# EAGLE design CCM_0019 (EAGLE 9.2.1)
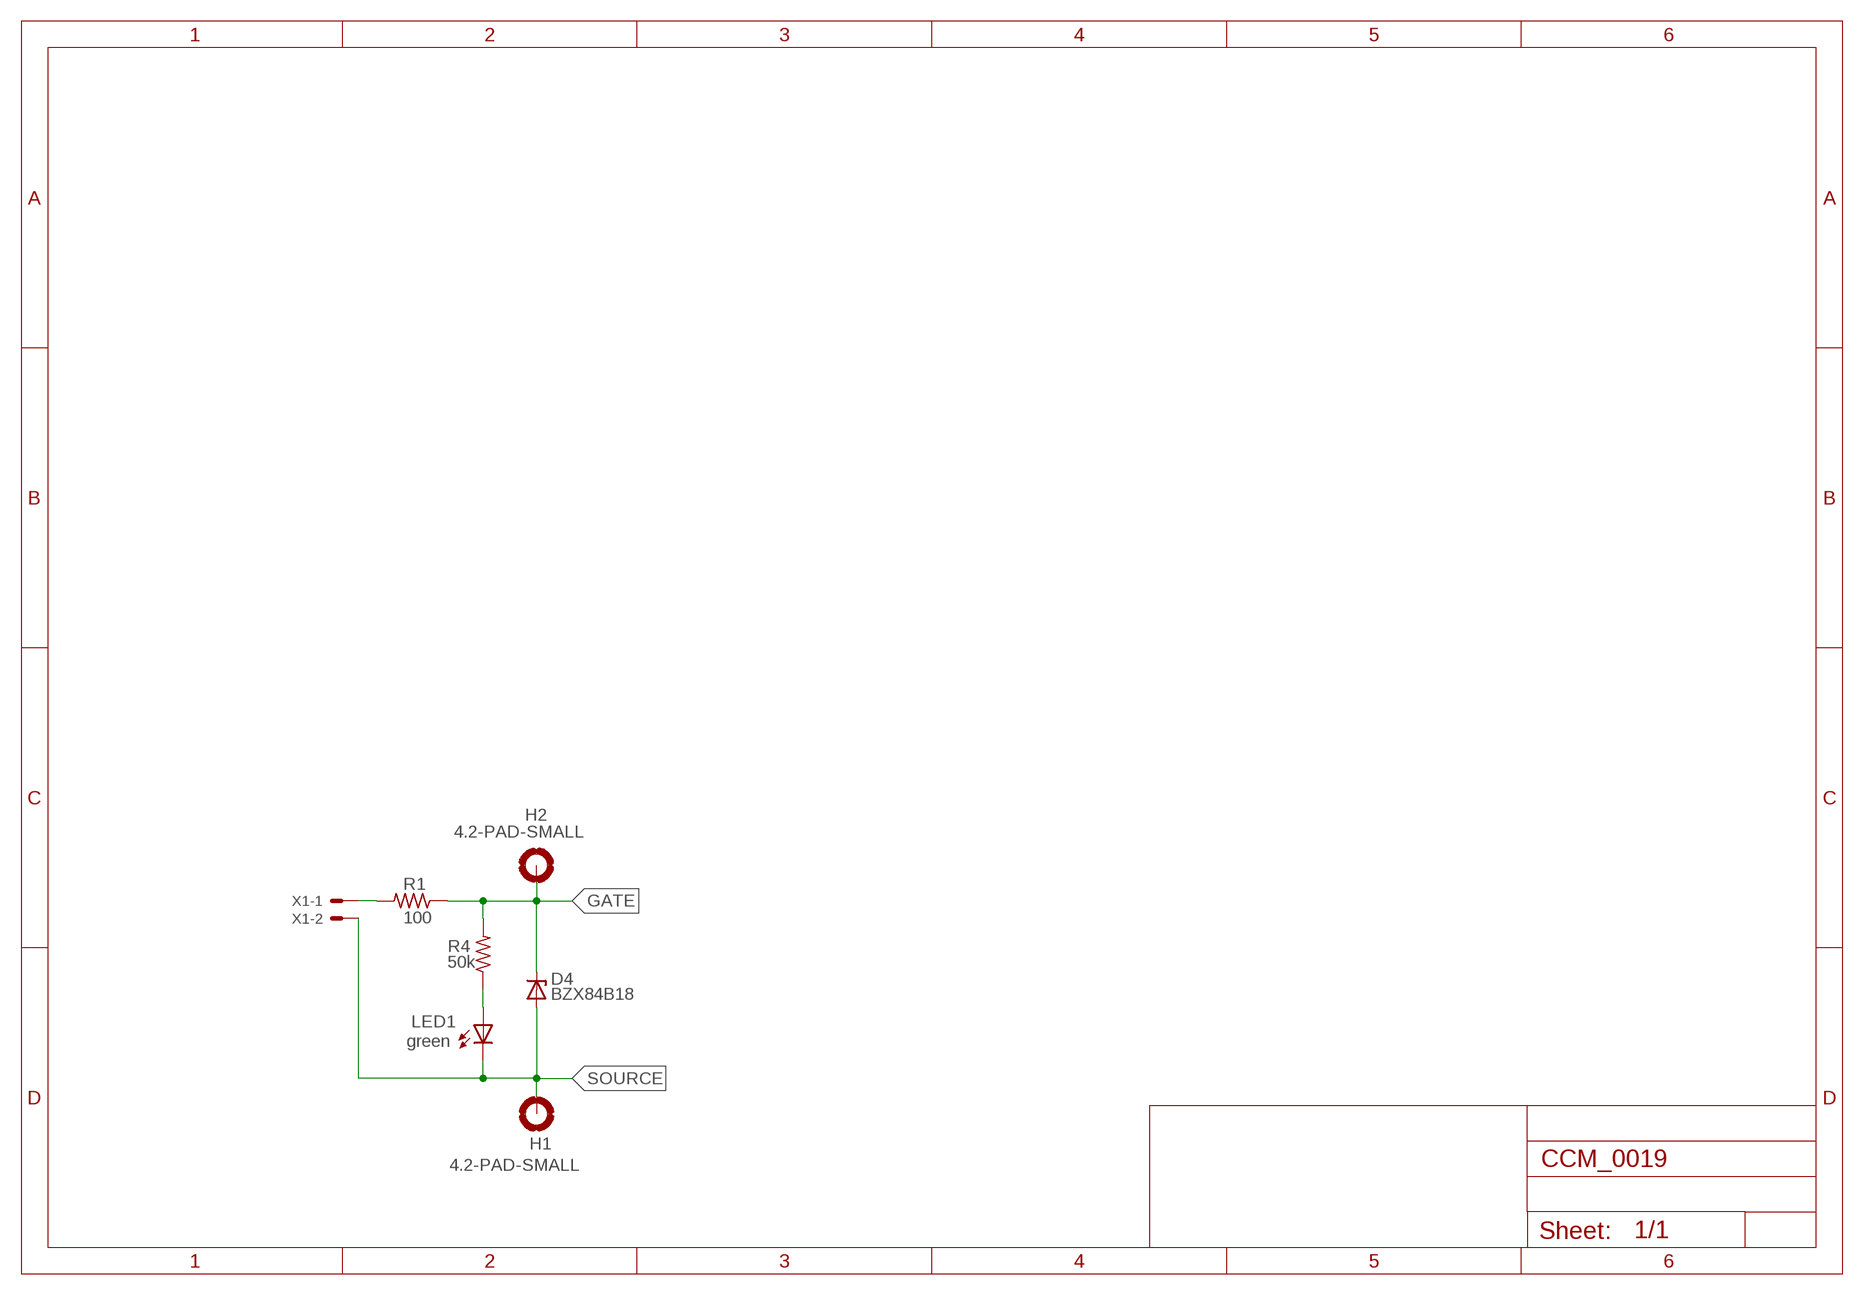
[diagram p0: schematic, sheet 1]

## Parts
D4  BZX84B18  ZENER-DIODESOT23  [SOT23]
H1  4.2-PAD-SMALL  [4.2-PAD-SMALL]
H2  4.2-PAD-SMALL  [4.2-PAD-SMALL]
LED1  green  LEDCHIPLED_0603  [CHIPLED_0603]
R1  100  RESISTOR0603  [0603]
R4  50k  RESISTOR0603  [0603]
X1  22-23-2021  [22-23-2021]

## Nets
GATE: D4.3(C) H2.B4,2(MOUNT) R1.1 R4.2
N$2: LED1.A R4.1
N$5: R1.2 X1.1
SOURCE: D4.1(A) H1.B4,2(MOUNT) LED1.C X1.2

## Library data of the parts
D4 = diode:ZENER-DIODE: Z-Diode
H1 H2 = noah:4.2-PAD-SMALL
LED1 = led:LED: LED OSRAM: - CHIPLED LG R971, LG N971, LY N971, LG Q971, LY Q971, LO R971, LY R971 LH N974, LH R974 LS Q976, LO Q976, LY Q976 LO Q996 - Hyper CHIPLED LW Q18S LB Q993, LB Q99A, LB R99A - SideLED LS A670, LO A670, LY A670, LG A670, LP A670 LB A673, LV A673, LT A673, LW A673 LH A674 LY A675 LS A676, LA A676, LO A676, LY A676, LW A676 LS A679, LY A679, LG A679 - Hyper Micro SIDELED® LS Y876, LA Y876, LO Y876, LY Y876 LT Y87S - SmartLED LW L88C, LW L88S LB L89C, LB L89S, LG L890 LS L89K, LO L89K, LY L89K LS L896, LA L896, LO L896, LY L896 - TOPLED LS T670, LO T670, LY T670, LG T670, LP T670 LSG T670, LSP T670, LSY T670, LOP T670, LYG T670 LG T671, LOG T671, LSG T671 LB T673, LV T673, LT T673, LW T673 LH T674 LS T676, LA T676, LO T676, LY T676, LB T676, LH T676, LSB T676, LW T676 LB T67C, LV T67C, LT T67C, LS T67K, LO T67K, LY T67K, LW E67C LS E67B, LA E67B, LO E67B, LY E67B, LB E67C, LV E67C, LT E67C LW T67C LS T679, LY T679, LG T679 LS T770, LO T770, LY T770, LG T770, LP T770 LB T773, LV T773, LT T773, LW T773 LH T774 LS E675, LA E675, LY E675, LS T675 LS T776, LA T776, LO T776, LY T776, LB T776 LHGB T686 LT T68C, LB T68C - Hyper Mini TOPLED® LB M676 - Mini TOPLED Santana® LG M470 LS M47K, LO M47K, LY M47K Source: http://www.osram.convergy.de LUXEON: - LUMILED® LXK2-PW12-R00, LXK2-PW12-S00, LXK2-PW14-U00, LXK2-PW14-V00 LXK2-PM12-R00, LXK2-PM12-S00, LXK2-PM14-U00 LXK2-PE12-Q00, LXK2-PE12-R00, LXK2-PE12-S00, LXK2-PE14-T00, LXK2-PE14-U00 LXK2-PB12-K00, LXK2-PB12-L00, LXK2-PB12-M00, LXK2-PB14-N00, LXK2-PB14-P00, LXK2-PB14-Q00 LXK2-PR12-L00, LXK2-PR12-M00, LXK2-PR14-Q00, LXK2-PR14-R00 LXK2-PD12-Q00, LXK2-PD12-R00, LXK2-PD12-S00 LXK2-PH12-R00, LXK2-PH12-S00 LXK2-PL12-P00, LXK2-PL12-Q00, LXK2-PL12-R00 Source: www.luxeon.com KINGBRIGHT: KA-3528ASYC Source: www.kingbright.com
R1 R4 = noah:RESISTOR: RESISTOR, American symbol
X1 = con-molex:22-23-2021: .100" (2.54mm) Center Header - 2 Pin; MF: MOLEX; MPN: 22-23-2021; OC_FARNELL: 1462926; OC_NEWARK: 25C3832

## Net classes
1 standard: width 0.61 mm, clearance 0.254 mm

## Board
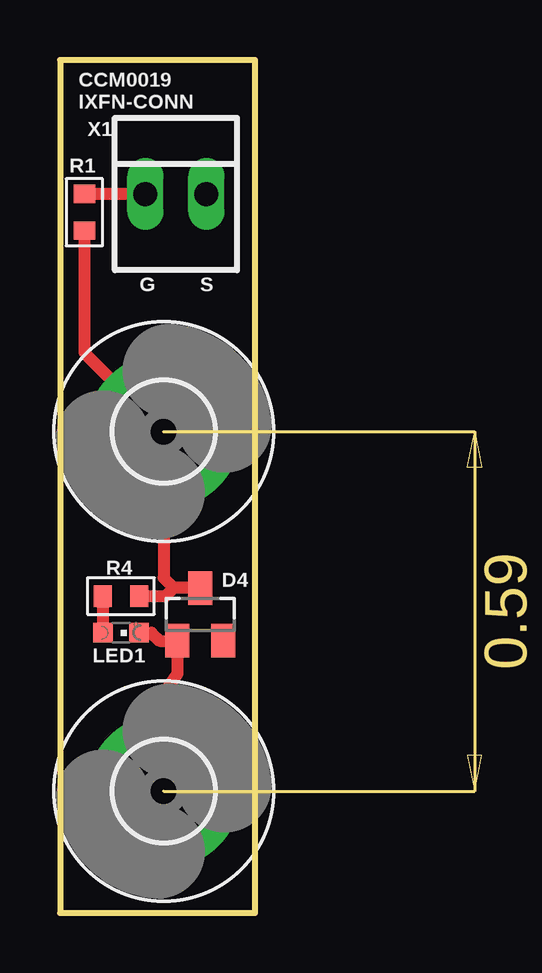
[diagram p1: board, top side]
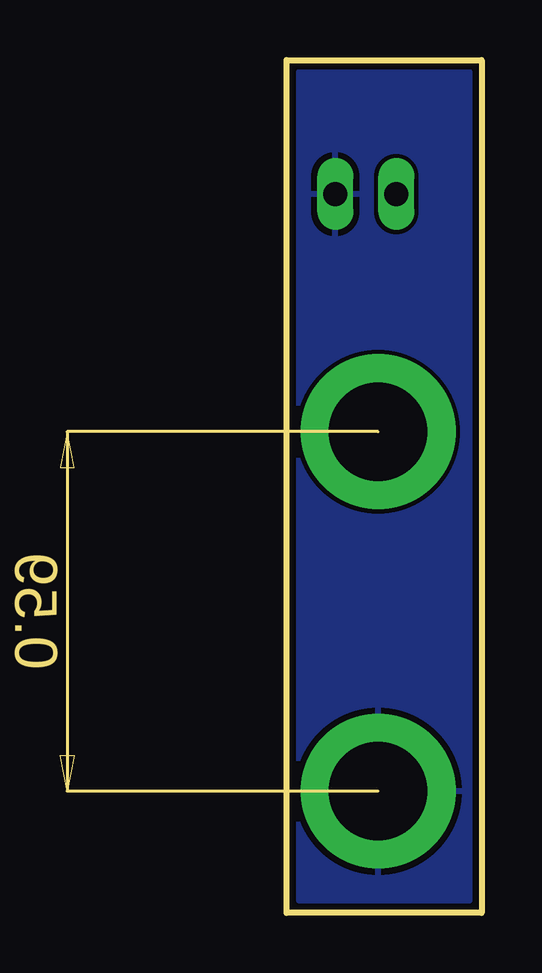
[diagram p2: board, bottom side, seen from below]

Size 8.13 x 35.56 mm. Coordinates in mm from the lower left corner, seen from the top.
Outline: 0,0 8.13,0 8.13,35.56 0,35.56 0,0
Copper layers (1*16): Top 0.035mm / dielectric 1.5mm / Bottom 0.035mm
Design rules "default *": minimum track width 10mil, minimum drill 10mil, track to track 7mil, track to pad 7mil, pad to pad 7mil, via to via 7mil, smd to smd 7mil, copper to edge 10mil, drill to drill 8mil, minimum pad ring 10mil, minimum via ring 8mil, stop-mask expansion 4mil, vias tented up to drill 0mil, thermal gap 10mil

### Footprints (pad centres in the part's own frame; a part is rotated, then mirrored left to right if it is on the bottom)
SOT23 = smd 1 x 1.4: 1 -0.95,-1.1; 2 0.95,-1.1; 3 0,1.1
4.2-PAD-SMALL = drill 4.1 pad 6.452: B4,2 0,0
CHIPLED_0603 = smd 0.8 x 0.8: A 0,-0.75; C 0,0.75
0603 = smd 0.762 x 0.889: 1 -0.762,0; 2 0.762,0
22-23-2021 = drill 1 long: 1 -1.27,0; 2 1.27,0

### Placement (x,y rotation side)
D4  5.84,12.45 0 top
H1  4.32,5.08 0 top
H2  4.32,20.07 0 top
LED1  2.54,11.68 270 top
R1  1.02,29.21 90 top
R4  2.54,13.21 0 top
X1  4.83,29.97 0 top

### Tracks (layer width: path | path; a pad name or v marks a point on that pad's centre or on a via)
GATE
  Top 0.508: D4.3 4.74,13.55 | 4.74,13.55 4.32,13.97 H2.B4,2 1.02,23.37 R1.1 | R4.2 4.4,13.21 4.74,13.55
N$2
  Top 0.508: R4.1 LED1.A
N$5
  Top 0.508: X1.1 R1.2
SOURCE
  Top 0.508: H1.B4,2 4.32,9.14 4.89,9.97 D4.1 4.15,11.35 3.81,11.68 LED1.C
  pour Bottom: 0.51,0.51 0.51,35.05 7.62,35.05 7.62,0.51

### Text on the board
tNames: CCM0019 / IXFN-CONN | G | S